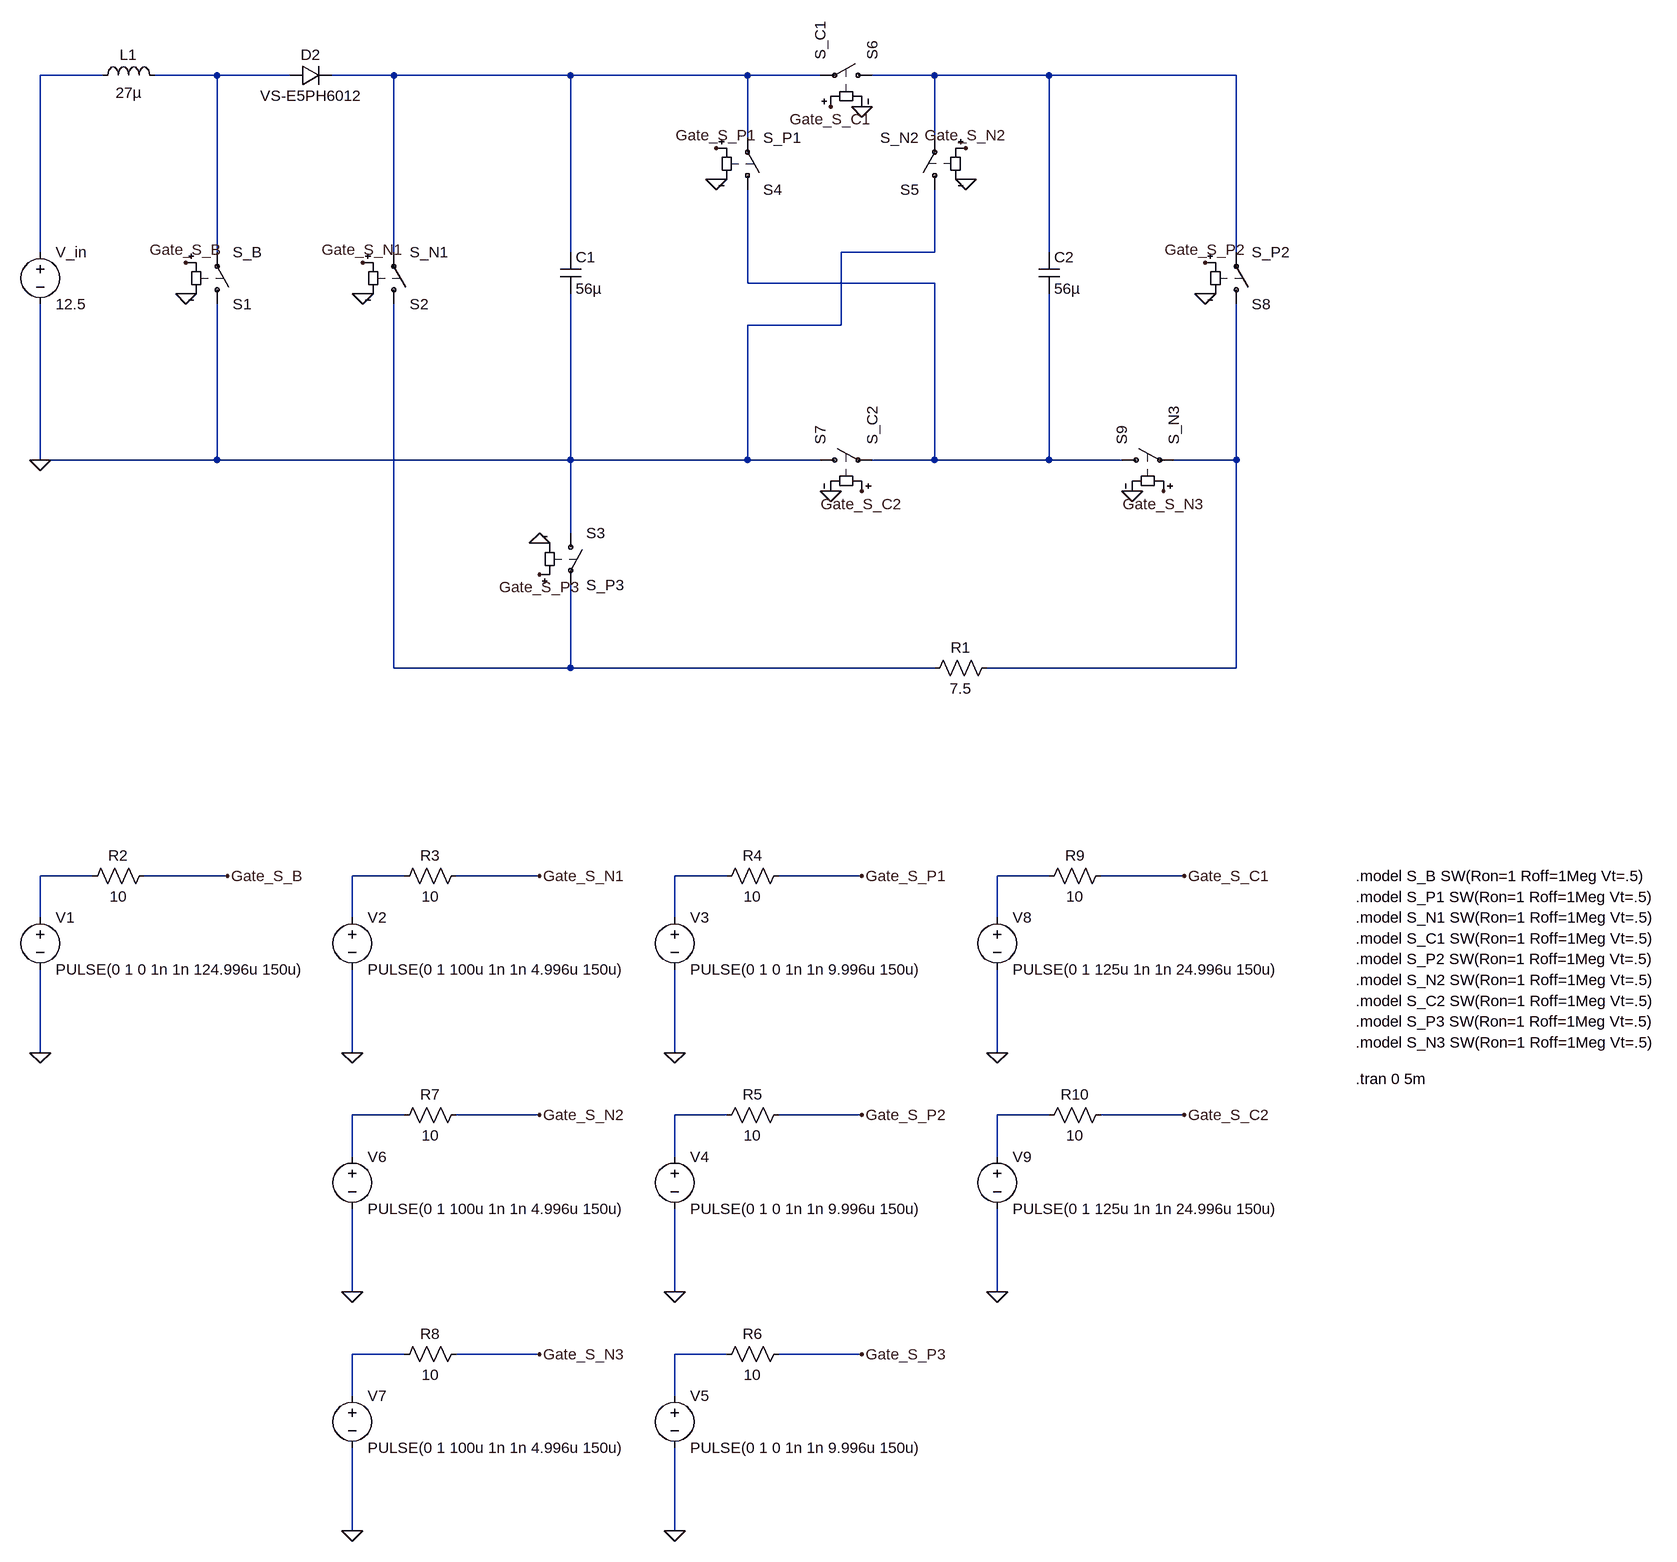
[diagram p0: schematic Resistive_Load.asc]
Resistive_Load.asc, the LTspice schematic file:
Version 4
SHEET 1 2616 2288
WIRE 224 32 128 32
WIRE 400 32 304 32
WIRE 512 32 400 32
WIRE 672 32 576 32
WIRE 944 32 672 32
WIRE 1216 32 944 32
WIRE 1328 32 1216 32
WIRE 1504 32 1408 32
WIRE 1680 32 1504 32
WIRE 1968 32 1680 32
WIRE 1216 128 1216 32
WIRE 1504 128 1504 32
WIRE 128 304 128 32
WIRE 400 304 400 32
WIRE 672 304 672 32
WIRE 944 304 944 32
WIRE 1504 304 1504 208
WIRE 1504 304 1360 304
WIRE 1680 304 1680 32
WIRE 1968 304 1968 32
WIRE 1216 352 1216 208
WIRE 1504 352 1216 352
WIRE 1360 416 1360 304
WIRE 1360 416 1216 416
WIRE 128 624 128 384
WIRE 400 624 400 384
WIRE 400 624 128 624
WIRE 944 624 944 368
WIRE 944 624 400 624
WIRE 1216 624 1216 416
WIRE 1216 624 944 624
WIRE 1328 624 1216 624
WIRE 1504 624 1504 352
WIRE 1504 624 1408 624
WIRE 1680 624 1680 368
WIRE 1680 624 1504 624
WIRE 1792 624 1680 624
WIRE 1968 624 1968 384
WIRE 1968 624 1872 624
WIRE 944 736 944 624
WIRE 672 944 672 384
WIRE 944 944 944 816
WIRE 944 944 672 944
WIRE 1504 944 944 944
WIRE 1968 944 1968 624
WIRE 1968 944 1584 944
WIRE 208 1264 128 1264
WIRE 416 1264 288 1264
WIRE 688 1264 608 1264
WIRE 896 1264 768 1264
WIRE 1184 1264 1104 1264
WIRE 1392 1264 1264 1264
WIRE 1680 1264 1600 1264
WIRE 1888 1264 1760 1264
WIRE 128 1328 128 1264
WIRE 608 1328 608 1264
WIRE 1104 1328 1104 1264
WIRE 1600 1328 1600 1264
WIRE 128 1536 128 1408
WIRE 608 1536 608 1408
WIRE 1104 1536 1104 1408
WIRE 1600 1536 1600 1408
WIRE 688 1632 608 1632
WIRE 896 1632 768 1632
WIRE 1184 1632 1104 1632
WIRE 1392 1632 1264 1632
WIRE 1680 1632 1600 1632
WIRE 1888 1632 1760 1632
WIRE 608 1696 608 1632
WIRE 1104 1696 1104 1632
WIRE 1600 1696 1600 1632
WIRE 608 1904 608 1776
WIRE 1104 1904 1104 1776
WIRE 1600 1904 1600 1776
WIRE 688 2000 608 2000
WIRE 896 2000 768 2000
WIRE 1184 2000 1104 2000
WIRE 1392 2000 1264 2000
WIRE 608 2064 608 2000
WIRE 1104 2064 1104 2000
WIRE 608 2272 608 2144
WIRE 1104 2272 1104 2144
FLAG 128 624 0
FLAG 416 1264 Gate_S_B
FLAG 352 368 0
FLAG 624 368 0
FLAG 1168 192 0
FLAG 1392 80 0
FLAG 1552 192 0
FLAG 1344 672 0
FLAG 1808 672 0
FLAG 1920 368 0
FLAG 896 752 0
FLAG 128 1536 0
FLAG 352 320 Gate_S_B
FLAG 896 1264 Gate_S_N1
FLAG 608 1536 0
FLAG 1392 1264 Gate_S_P1
FLAG 1104 1536 0
FLAG 624 320 Gate_S_N1
FLAG 1168 144 Gate_S_P1
FLAG 1392 1632 Gate_S_P2
FLAG 1104 1904 0
FLAG 1920 320 Gate_S_P2
FLAG 1392 2000 Gate_S_P3
FLAG 1104 2272 0
FLAG 896 800 Gate_S_P3
FLAG 896 1632 Gate_S_N2
FLAG 608 1904 0
FLAG 1552 144 Gate_S_N2
FLAG 896 2000 Gate_S_N3
FLAG 608 2272 0
FLAG 1856 672 Gate_S_N3
FLAG 1888 1264 Gate_S_C1
FLAG 1600 1536 0
FLAG 1344 80 Gate_S_C1
FLAG 1888 1632 Gate_S_C2
FLAG 1600 1904 0
FLAG 1392 672 Gate_S_C2
SYMBOL voltage 128 288 R0
SYMATTR InstName V_in
SYMATTR Value 12.5
SYMBOL sw 400 400 M180
SYMATTR InstName S1
SYMATTR Value S_B
SYMBOL diode 512 48 R270
WINDOW 0 32 32 VTop 2
WINDOW 3 0 32 VBottom 2
SYMATTR InstName D2
SYMATTR Value VS-E5PH6012
SYMBOL sw 672 400 M180
SYMATTR InstName S2
SYMATTR Value S_N1
SYMBOL cap 928 304 R0
SYMATTR InstName C1
SYMATTR Value 56µ
SYMATTR SpiceLine Rser=11.5m Lser=13.4n mfg="Würth Elektronik" pn="890764429002CS WCAP-FTDB 52.5x57x43.5x29.5x4" type="Box"
SYMBOL sw 944 720 R0
SYMATTR InstName S3
SYMATTR Value S_P3
SYMBOL sw 1216 224 M180
SYMATTR InstName S4
SYMATTR Value S_P1
SYMBOL sw 1504 224 R180
SYMATTR InstName S5
SYMATTR Value S_N2
SYMBOL sw 1424 32 M270
SYMATTR InstName S6
SYMATTR Value S_C1
SYMBOL sw 1312 624 R270
SYMATTR InstName S7
SYMATTR Value S_C2
SYMBOL cap 1664 304 R0
SYMATTR InstName C2
SYMATTR Value 56µ
SYMATTR SpiceLine Rser=11.5m Lser=13.4n mfg="Würth Elektronik" pn="890764429002CS WCAP-FTDB 52.5x57x43.5x29.5x4" type="Box"
SYMBOL sw 1968 400 M180
SYMATTR InstName S8
SYMATTR Value S_P2
SYMBOL sw 1776 624 R270
SYMATTR InstName S9
SYMATTR Value S_N3
SYMBOL Res 1600 928 R90
WINDOW 0 0 56 VBottom 2
WINDOW 3 32 56 VTop 2
SYMATTR InstName R1
SYMATTR Value 7.5
SYMBOL voltage 128 1312 R0
SYMATTR InstName V1
SYMATTR Value PULSE(0 1 0 1n 1n 124.996u 150u)
SYMBOL res 304 1248 R90
WINDOW 0 0 56 VBottom 2
WINDOW 3 32 56 VTop 2
SYMATTR InstName R2
SYMATTR Value 10
SYMBOL voltage 608 1312 R0
SYMATTR InstName V2
SYMATTR Value PULSE(0 1 100u 1n 1n 4.996u 150u)
SYMBOL res 784 1248 R90
WINDOW 0 0 56 VBottom 2
WINDOW 3 32 56 VTop 2
SYMATTR InstName R3
SYMATTR Value 10
SYMBOL voltage 1104 1312 R0
SYMATTR InstName V3
SYMATTR Value PULSE(0 1 0 1n 1n 9.996u 150u)
SYMBOL res 1280 1248 R90
WINDOW 0 0 56 VBottom 2
WINDOW 3 32 56 VTop 2
SYMATTR InstName R4
SYMATTR Value 10
SYMBOL voltage 1104 1680 R0
SYMATTR InstName V4
SYMATTR Value PULSE(0 1 0 1n 1n 9.996u 150u)
SYMBOL res 1280 1616 R90
WINDOW 0 0 56 VBottom 2
WINDOW 3 32 56 VTop 2
SYMATTR InstName R5
SYMATTR Value 10
SYMBOL voltage 1104 2048 R0
SYMATTR InstName V5
SYMATTR Value PULSE(0 1 0 1n 1n 9.996u 150u)
SYMBOL res 1280 1984 R90
WINDOW 0 0 56 VBottom 2
WINDOW 3 32 56 VTop 2
SYMATTR InstName R6
SYMATTR Value 10
SYMBOL voltage 608 1680 R0
SYMATTR InstName V6
SYMATTR Value PULSE(0 1 100u 1n 1n 4.996u 150u)
SYMBOL res 784 1616 R90
WINDOW 0 0 56 VBottom 2
WINDOW 3 32 56 VTop 2
SYMATTR InstName R7
SYMATTR Value 10
SYMBOL voltage 608 2048 R0
SYMATTR InstName V7
SYMATTR Value PULSE(0 1 100u 1n 1n 4.996u 150u)
SYMBOL res 784 1984 R90
WINDOW 0 0 56 VBottom 2
WINDOW 3 32 56 VTop 2
SYMATTR InstName R8
SYMATTR Value 10
SYMBOL voltage 1600 1312 R0
SYMATTR InstName V8
SYMATTR Value PULSE(0 1 125u 1n 1n 24.996u 150u)
SYMBOL res 1776 1248 R90
WINDOW 0 0 56 VBottom 2
WINDOW 3 32 56 VTop 2
SYMATTR InstName R9
SYMATTR Value 10
SYMBOL voltage 1600 1680 R0
SYMATTR InstName V9
SYMATTR Value PULSE(0 1 125u 1n 1n 24.996u 150u)
SYMBOL res 1776 1616 R90
WINDOW 0 0 56 VBottom 2
WINDOW 3 32 56 VTop 2
SYMATTR InstName R10
SYMATTR Value 10
SYMBOL ind 208 48 R270
WINDOW 0 32 56 VTop 2
WINDOW 3 5 56 VBottom 2
SYMATTR InstName L1
SYMATTR Value 27µ
SYMATTR SpiceLine Ipk=49 Rser=2.8m Rpar=1.413K Cpar=0 mfg="Coilcraft" pn="AGP4233-153"
TEXT 2152 1264 Left 2 !.model S_B SW(Ron=1 Roff=1Meg Vt=.5)
TEXT 2152 1296 Left 2 !.model S_P1 SW(Ron=1 Roff=1Meg Vt=.5)
TEXT 2152 1328 Left 2 !.model S_N1 SW(Ron=1 Roff=1Meg Vt=.5)
TEXT 2152 1360 Left 2 !.model S_C1 SW(Ron=1 Roff=1Meg Vt=.5)
TEXT 2152 1392 Left 2 !.model S_P2 SW(Ron=1 Roff=1Meg Vt=.5)
TEXT 2152 1424 Left 2 !.model S_N2 SW(Ron=1 Roff=1Meg Vt=.5)
TEXT 2152 1456 Left 2 !.model S_C2 SW(Ron=1 Roff=1Meg Vt=.5)
TEXT 2152 1488 Left 2 !.model S_P3 SW(Ron=1 Roff=1Meg Vt=.5)
TEXT 2152 1520 Left 2 !.model S_N3 SW(Ron=1 Roff=1Meg Vt=.5)
TEXT 2152 1576 Left 2 !.tran 0 5m

The netlist it stands for:
* Resistive_Load.asc
V_in N001 0 12.5
S1 0 N002 Gate_S_B 0 S_B
D2 N002 N003 VS-E5PH6012
S2 N007 N003 Gate_S_N1 0 S_N1
C1 N003 0 56µ Rser=11.5m Lser=13.4n mfg="Würth Elektronik" pn="890764429002CS WCAP-FTDB 52.5x57x43.5x29.5x4" type="Box"
S3 0 N007 Gate_S_P3 0 S_P3
S4 N005 N003 Gate_S_P1 0 S_P1
S5 0 N004 Gate_S_N2 0 S_N2
S6 N004 N003 Gate_S_C1 0 S_C1
S7 0 N005 Gate_S_C2 0 S_C2
C2 N004 N005 56µ Rser=11.5m Lser=13.4n mfg="Würth Elektronik" pn="890764429002CS WCAP-FTDB 52.5x57x43.5x29.5x4" type="Box"
S8 N006 N004 Gate_S_P2 0 S_P2
S9 N005 N006 Gate_S_N3 0 S_N3
R1 N006 N007 7.5
V1 N008 0 PULSE(0 1 0 1n 1n 124.996u 150u)
R2 Gate_S_B N008 10
V2 N009 0 PULSE(0 1 100u 1n 1n 4.996u 150u)
R3 Gate_S_N1 N009 10
V3 N010 0 PULSE(0 1 0 1n 1n 9.996u 150u)
R4 Gate_S_P1 N010 10
V4 N013 0 PULSE(0 1 0 1n 1n 9.996u 150u)
R5 Gate_S_P2 N013 10
V5 N016 0 PULSE(0 1 0 1n 1n 9.996u 150u)
R6 Gate_S_P3 N016 10
V6 N012 0 PULSE(0 1 100u 1n 1n 4.996u 150u)
R7 Gate_S_N2 N012 10
V7 N015 0 PULSE(0 1 100u 1n 1n 4.996u 150u)
R8 Gate_S_N3 N015 10
V8 N011 0 PULSE(0 1 125u 1n 1n 24.996u 150u)
R9 Gate_S_C1 N011 10
V9 N014 0 PULSE(0 1 125u 1n 1n 24.996u 150u)
R10 Gate_S_C2 N014 10
L1 N001 N002 27µ Ipk=49 Rser=2.8m Rpar=1.413K Cpar=0 mfg="Coilcraft" pn="AGP4233-153"
.model D D
.lib standard.dio
.model S_B SW(Ron=1 Roff=1Meg Vt=.5)
.model S_P1 SW(Ron=1 Roff=1Meg Vt=.5)
.model S_N1 SW(Ron=1 Roff=1Meg Vt=.5)
.model S_C1 SW(Ron=1 Roff=1Meg Vt=.5)
.model S_P2 SW(Ron=1 Roff=1Meg Vt=.5)
.model S_N2 SW(Ron=1 Roff=1Meg Vt=.5)
.model S_C2 SW(Ron=1 Roff=1Meg Vt=.5)
.model S_P3 SW(Ron=1 Roff=1Meg Vt=.5)
.model S_N3 SW(Ron=1 Roff=1Meg Vt=.5)
.tran 0 5m
.backanno
.end